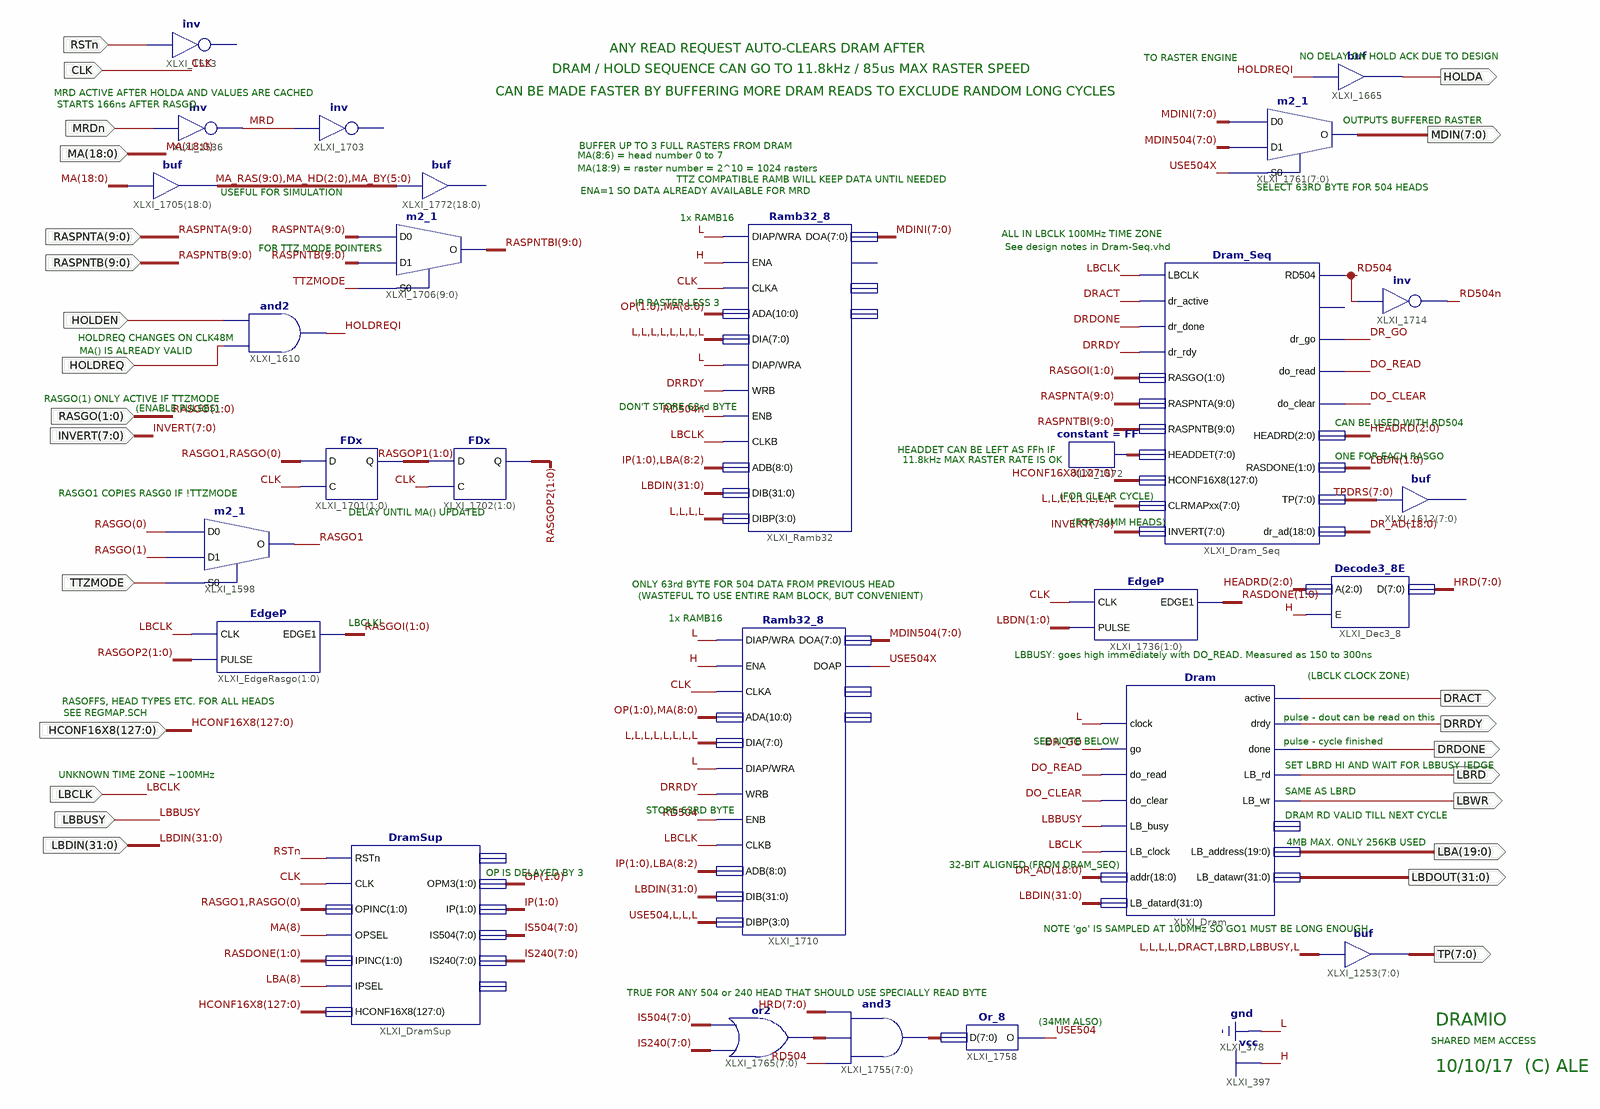
[diagram p0: schematic sheet 1]
// Xilinx ISE schematic DramIo.sch (zynq) as structural Verilog: 27 symbols, 25 ports
module DramIo (
  input  CLK,
  input  [31:0] LBDIN,
  input  LBBUSY,
  input  LBCLK,
  input  HOLDREQ,
  input  HOLDEN,
  input  TTZMODE,
  input  [1:0] RASGO,
  input  [9:0] RASPNTA,
  input  [9:0] RASPNTB,
  input  RSTn,
  input  [127:0] HCONF16X8,
  input  [7:0] INVERT,
  input  MRDn,
  input  [18:0] MA,
  output DRRDY,
  output DRACT,
  output [7:0] TP,
  output DRDONE,
  output LBRD,
  output LBWR,
  output [19:0] LBA,
  output [31:0] LBDOUT,
  output HOLDA,
  output [7:0] MDIN
);

  wire DO_CLEAR, DO_READ, DR_GO, HOLDREQI, MRD, RASGO1, RD504, RD504n, USE504, USE504X;
  wire [1:0] IP, LBDN, OP, RASDONE, RASGOI, RASGOP1, RASGOP2;
  wire [2:0] HEADRD, MA_HD;
  wire [5:0] MA_BY;
  wire [7:0] HRD, IS240, IS504, MDIN504, MDINI, TPDRS, XLXN_310, XLXN_329, XLXN_371;
  wire [9:0] MA_RAS, RASPNTBI;
  wire [18:0] DR_AD;

  assign TP = {4'b0000, DRACT, LBRD, LBBUSY, 1'b0};  // buf XLXI_1253[7..0], 8 bits wide
  Dram XLXI_Dram (
    .clock(1'b0), .go(DR_GO), .do_read(DO_READ), .do_clear(DO_CLEAR), .LB_busy(LBBUSY), .LB_clock(LBCLK),
    .addr(DR_AD), .LB_datard(LBDIN), .active(DRACT), .drdy(DRRDY), .done(DRDONE), .LB_rd(LBRD), .LB_wr(LBWR),
    .LB_address(LBA), .LB_datawr(LBDOUT));  // open: dout
  and XLXI_1610 (HOLDREQI, HOLDREQ, HOLDEN);
  m2_1 XLXI_1598 (.D0(RASGO[0]), .D1(RASGO[1]), .S0(TTZMODE), .O(RASGO1));
  EdgeP XLXI_EdgeRasgo[1:0] (.CLK(LBCLK), .EDGE1(RASGOI), .PULSE(RASGOP2));
  // inv XLXI_1523 has open pins: I=RSTn, O=open
  m2_1 XLXI_1706[9:0] (.D0(RASPNTA), .D1(RASPNTB), .S0(TTZMODE), .O(RASPNTBI));
  FDx XLXI_1702[1:0] (.C(CLK), .D(RASGOP1), .Q(RASGOP2));
  FDx XLXI_1701[1:0] (.C(CLK), .D({RASGO1, RASGO[0]}), .Q(RASGOP1));
  Ramb32_8 XLXI_Ramb32 (
    .ADA({OP, MA[8:0]}), .ADB({IP, LBA[8:2]}), .CLKA(CLK), .CLKB(LBCLK), .DIA({8{1'b0}}), .DIAP(1'b0),
    .DIB(LBDIN), .DIBP(4'b0000), .DOA(MDINI), .ENA(1'b1), .ENB(RD504n), .WRA(1'b0), .WRB(DRRDY));  // open: DOAP, DOB, DOBP
  Ramb32_8 XLXI_1710 (
    .ADA({OP, MA[8:0]}), .ADB({IP, LBA[8:2]}), .CLKA(CLK), .CLKB(LBCLK), .DIA({8{1'b0}}), .DIAP(1'b0),
    .DIB(LBDIN), .DIBP({USE504, 3'b000}), .DOA(MDIN504), .DOAP(USE504X), .ENA(1'b1), .ENB(RD504), .WRA(1'b0),
    .WRB(DRRDY));  // open: DOB, DOBP
  EdgeP XLXI_1736[1:0] (.CLK(CLK), .EDGE1(RASDONE), .PULSE(LBDN));
  Decode3_8E XLXI_Dec3_8 (.A(HEADRD), .D(HRD), .E(1'b1));
  DramSup XLXI_DramSup (
    .CLK(CLK), .HCONF16X8(HCONF16X8), .IP(IP), .IPINC(RASDONE), .IPSEL(LBA[8]), .IS240(IS240), .IS504(IS504),
    .OPINC({RASGO1, RASGO[0]}), .OPM3(OP), .OPSEL(MA[8]), .RSTn(RSTn));  // open: OP, CLRMAP
  assign XLXN_310 = {8{RD504}} & XLXN_329 & HRD;  // and3 XLXI_1755[7..0], 8 bits wide
  Or_8 XLXI_1758 (.D(XLXN_310), .O(USE504));
  assign XLXN_329 = IS240 | IS504;  // or2 XLXI_1765[7..0], 8 bits wide
  buf XLXI_1665 (HOLDA, HOLDREQI);
  m2_1 XLXI_1761[7:0] (.D0(MDINI), .D1(MDIN504), .S0(USE504X), .O(MDIN));
  Dram_Seq XLXI_Dram_Seq (
    .LBCLK(LBCLK), .dr_active(DRACT), .dr_done(DRDONE), .dr_rdy(DRRDY), .RASGO(RASGOI), .RASPNTA(RASPNTA),
    .RASPNTB(RASPNTBI), .HEADDET(XLXN_371), .HCONF16X8(HCONF16X8), .CLRMAPxx({8{1'b0}}), .INVERT(INVERT),
    .RD504(RD504), .dr_go(DR_GO), .do_read(DO_READ), .do_clear(DO_CLEAR), .HEADRD(HEADRD), .RASDONE(LBDN),
    .TP(TPDRS), .dr_ad(DR_AD));  // open: CLR504
  not XLXI_1714 (RD504n, RD504);
  // buf XLXI_1612[7..0] has open pins: I=TPDRS, O=open
  constant #(.CValue("FF")) XLXI_1572 (.O(XLXN_371));
  not XLXI_1536 (MRD, MRDn);
  // inv XLXI_1703 has open pins: I=MRD, O=open
  assign {MA_RAS, MA_HD, MA_BY} = MA;  // buf XLXI_1705[18..0], 19 bits wide
  // buf XLXI_1772[18..0] has open pins: I={MA_RAS, MA_HD, MA_BY}, O=open

  // Notes on the sheet:
  //   ANY READ REQUEST AUTO-CLEARS DRAM AFTER
  //   NO DELAY ON HOLD ACK DUE TO DESIGN
  //   TO RASTER ENGINE
  //   DRAM / HOLD SEQUENCE CAN GO TO 11.8kHz / 85us MAX RASTER SPEED
  //   CAN BE MADE FASTER BY BUFFERING MORE DRAM READS TO EXCLUDE RANDOM LONG CYCLES
  //   MRD ACTIVE AFTER HOLDA AND VALUES ARE CACHED
  //   STARTS 166ns AFTER RASGO
  //   OUTPUTS BUFFERED RASTER
  //   BUFFER UP TO 3 FULL RASTERS FROM DRAM
  //   MA(8:6) = head number 0 to 7
  //   MA(18:9) = raster number = 2^10 = 1024 rasters
  //   TTZ COMPATIBLE RAMB WILL KEEP DATA UNTIL NEEDED
  //   SELECT 63RD BYTE FOR 504 HEADS
  //   ENA=1 SO DATA ALREADY AVAILABLE FOR MRD
  //   USEFUL FOR SIMULATION
  //   1x RAMB16
  //   ALL IN LBCLK 100MHz TIME ZONE
  //   See design notes in Dram-Seq.vhd
  //   FOR TTZ MODE POINTERS
  //   IP RASTER LESS 3
  //   HOLDREQ CHANGES ON CLK48M
  //   MA() IS ALREADY VALID
  //   RASGO(1) ONLY ACTIVE IF TTZMODE
  //   DON'T STORE 63rd BYTE
  //   (ENABLE PULSES)
  //   CAN BE USED WITH RD504
  //   HEADDET CAN BE LEFT AS FFh IF
  //   ONE FOR EACH RASGO
  //   11.8kHz MAX RASTER RATE IS OK
  //   RASGO1 COPIES RASG0 IF !TTZMODE
  //   (FOR CLEAR CYCLE)
  //   DELAY UNTIL MA() UPDATED
  //   (FOR 34MM HEADS)
  //   ONLY 63rd BYTE FOR 504 DATA FROM PREVIOUS HEAD
  //   (WASTEFUL TO USE ENTIRE RAM BLOCK, BUT CONVENIENT)
  //   1x RAMB16
  //   LBCLK!
  //   LBBUSY: goes high immediately with DO_READ. Measured as 150 to 300ns
  //   (LBCLK CLOCK ZONE)
  //   RASOFFS, HEAD TYPES ETC. FOR ALL HEADS
  //   SEE REGMAP.SCH
  //   pulse - dout can be read on this
  //   SEE NOTE BELOW
  //   pulse - cycle finished
  //   SET LBRD HI AND WAIT FOR LBBUSY !EDGE
  //   UNKNOWN TIME ZONE ~100MHz
  //   SAME AS LBRD
  //   STORE 63RD BYTE
  //   DRAM RD VALID TILL NEXT CYCLE
  //   4MB MAX. ONLY 256KB USED
  //   32-BIT ALIGNED (FROM DRAM_SEQ)
  //   OP IS DELAYED BY 3
  //   NOTE 'go' IS SAMPLED AT 100MHz SO GO1 MUST BE LONG ENOUGH
  //   TRUE FOR ANY 504 or 240 HEAD THAT SHOULD USE SPECIALLY READ BYTE
  //   DRAMIO
  //   (34MM ALSO)
  //   SHARED MEM ACCESS
  //   10/10/17  (C) ALE
endmodule
